# Altium schematic sheet 2024_Nov_24_Esp32.SchDoc
size A4; SheetNumber: 1; SheetTotal: 1
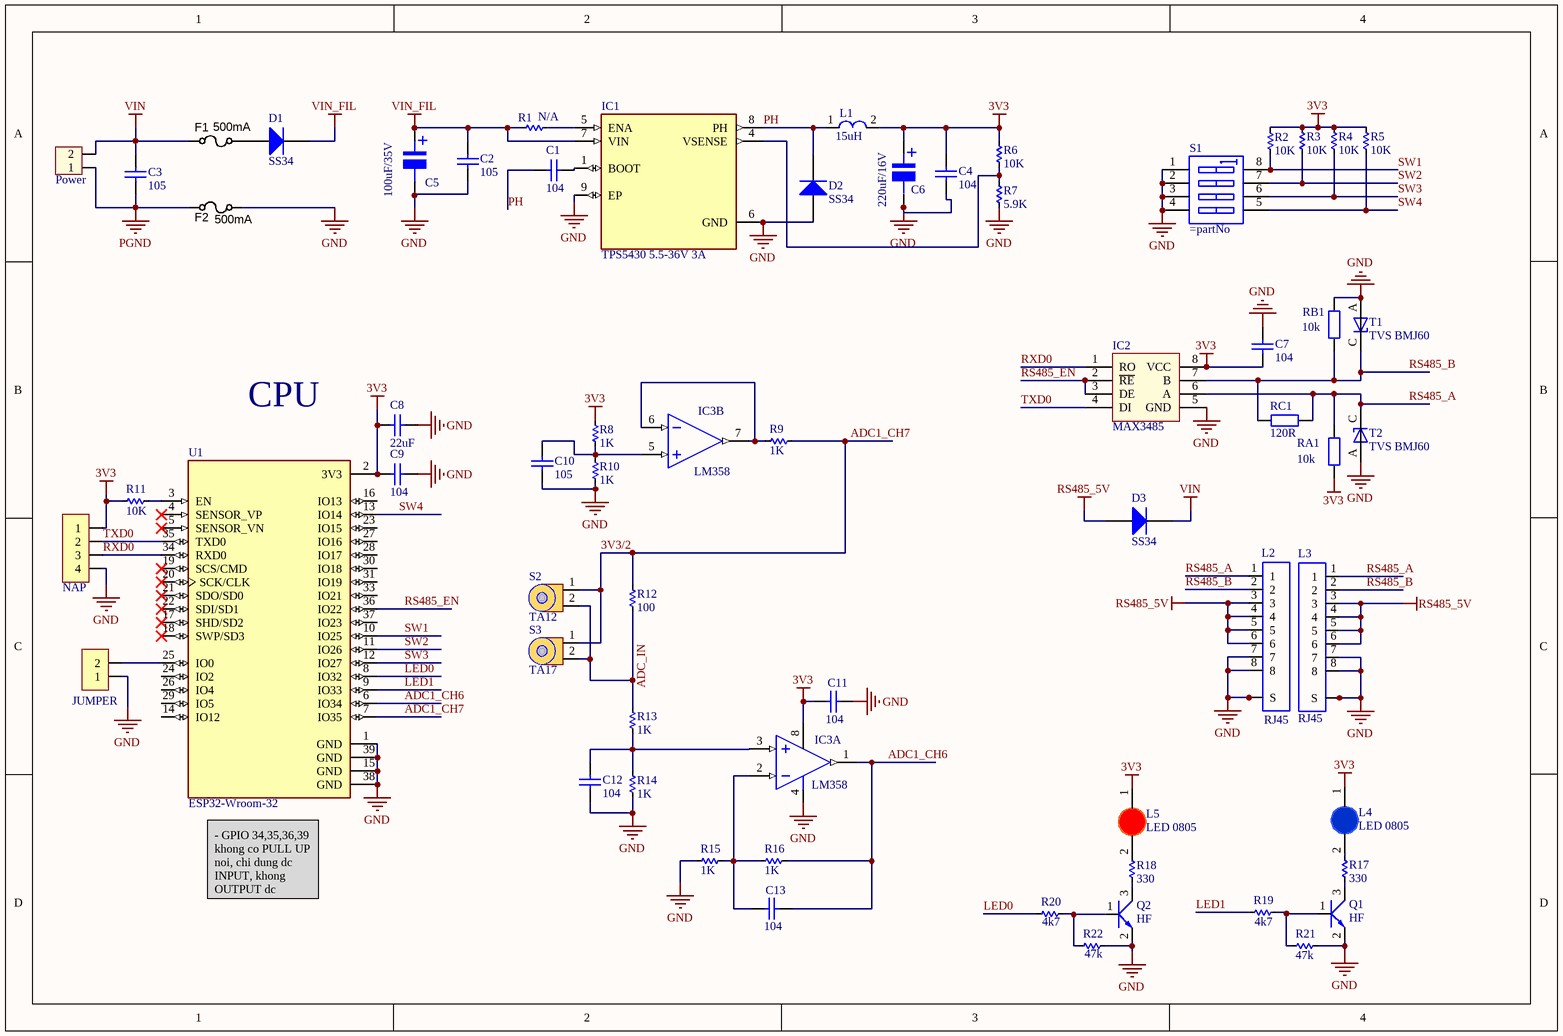
[diagram p0: 2024_Nov_24_Esp32.SchDoc]

## Parts
C1  104  [tu 0805]
C2  105  [tu 0805]
C3  105  [tu 0805]
C4  104  [tu 0805]
C5  100uF/35V  [tu nhom 8 (f)]
C6  220uF/16V  [tu nhom 6.3 (d)]
C7  104  [tu 0805]
C8  22uF  [tu 0805]
C9  104  [tu 0805]
C10  105  [tu 0805]
C11  104  [tu 0805]
C12  104  [tu 0805]
C13  104  [tu 0805]
D1  SS34  [DIODE SMA]
D2  SS34  [DIODE SMA]
D3  SS34  [DIODE SMA]
F1  value 500mA  [TU 0805]  (hidden comment: Fast Acting)
F2  value 500mA  [TU 0805]  (hidden comment: Fast Acting)
H1  Power  [XH2.54M-2]
IC1  TPS5430 5.5-36V 3A  [TPS5430]
IC2  MAX3485  [SOp 8]
IC3  LM358  [SO8]  (parts A,B of 2)
JP1  NAP  [JP 1x4 DT]
JP2  JUMPER  [JP 1x2 DT]
L1  15uH  [L-SMD-M-7.3x4.5]
L2  RJ45  [Ethernet HR911105A]
L3  RJ45  [Ethernet HR911105A]
L4  LED 0805  [LED-0805-Blue]
L5  LED 0805  [LED-0805-Red]
Q1  HF  [SOT23]
Q2  HF  [SOT23]
R1  N/A  [RES-SMD-0805]
R2  10K  [RES-SMD-0805]
R3  10K  [RES-SMD-0805]
R4  10K  [RES-SMD-0805]
R5  10K  [RES-SMD-0805]
R6  10K  [RES-SMD-0805]
R7  5.9K  [RES-SMD-0805]
R8  1K  [RES-SMD-0805]
R9  1K  [RES-SMD-0805]
R10  1K  [RES-SMD-0805]
R11  10K  [RES-SMD-0805]
R12  100  [RES-SMD-0805]
R13  1K  [RES-SMD-0805]
R14  1K  [RES-SMD-0805]
R15  1K  [RES-SMD-0805]
R16  1K  [RES-SMD-0805]
R17  330  [RES-SMD-0805]
R18  330  [RES-SMD-0805]
R19  4k7  [RES-SMD-0805]
R20  4k7  [RES-SMD-0805]
R21  47k  [RES-SMD-0805]
R22  47k  [RES-SMD-0805]
RA1  10k  [SM-RES-0805]
RB1  10k  [SM-RES-0805]
RC1  120R  [SM-RES-0805]
S1  (no value)  [SW-DIP4]
S2  TA12  [TA12]
S3  TA17  [TA12]
T1  TVS BMJ60  [TVS BMJ60]
T2  TVS BMJ60  [TVS BMJ60]
U1  ESP32-Wroom-32  [ESP32-Wroom-32]

## Nets
3V3: C4.2 C6.1 C7.1 C8.2 C9.2 C11.2 IC2.8(VCC) IC3.8(+V) JP1.1 L1.2 L4.1(A) L5.1(A) R2.2 R3.2 R4.2 R5.2 R6.1 R8.1 R11.1 RA1.1 U1.2(3V3)
GND: C2.2 C4.1 C5.2 C6.2 C7.2 C8.1 C9.1 C10.2 C11.1 C12.1 D2.1(A) F2.2 IC1.6(GND) IC1.9(EP) IC2.5(GND) IC3.4(-V) JP1.4 JP2.1 L2.7 L2.8 L2.S1(S) L2.S2(S) L3.7 L3.8 L3.S1(S) L3.S2(S) Q1.2(E) Q2.2(E) R7.2 R10.2 R14.2 R15.1 R21.1 R22.1 RB1.2 S1.1 S1.2 S1.3 S1.4 T1.A T2.A U1.1(GND) U1.15(GND) U1.38(GND) U1.39(GND)
PGND: C3.2 F2.1 H1.1
RS485_5V: D3.1(A) L2.3 L2.4 L2.5 L2.6 L3.3 L3.4 L3.5 L3.6
VIN: C3.1 D3.2(K) F1.1 H1.2
VIN_FIL: C2.1 C5.1 D1.2(K) IC1.7(VIN) R1.2
3V3/2: R9.2 R12.1 S2.1 S3.1 U1.7(IO35)  [also labelled ADC1_CH7]
ADC1_CH6: C13.1 IC3.1(OUT) R16.2 U1.6(IO34)
ADC_IN: R12.2 R13.1 S2.2 S3.2
LED0: R20.2 U1.8(IO32)
LED1: R19.2 U1.9(IO33)
PH: C1.1 D2.2(K) IC1.8(PH) L1.1
RS485_A: IC2.6(A) L2.1 L3.1 RA1.2 RC1.1 T2.C
RS485_B: IC2.7(B) L2.2 L3.2 RB1.1 RC1.2 T1.C
RS485_EN: IC2.2(~{RE}) IC2.3(DE) U1.36(IO22)
RXD0: IC2.1(RO) JP1.3 U1.34(RXD0)
SW1: R2.1 S1.8 U1.10(IO25)
SW2: R3.1 S1.7 U1.11(IO26)
SW3: R4.1 S1.6 U1.12(IO27)
SW4: R5.1 S1.5 U1.13(IO14)
TXD0: IC2.4(DI) JP1.2 U1.35(TXD0)
NetC1_2: C1.2 IC1.1(BOOT)
NetC10_1: C10.1 IC3.5(IN+) R8.2 R10.1
NetC12_2: C12.2 IC3.3(IN+) R13.2 R14.1
NetC13_2: C13.2 IC3.2(IN-) R15.2 R16.1
NetD1_1: D1.1(A) F1.2
NetIC1_4: IC1.4(VSENSE) R6.2 R7.1
NetIC1_5: IC1.5(ENA) R1.1
NetIC3_6: IC3.6(IN-) IC3.7(OUT) R9.1
NetJP2_2: JP2.2 U1.25(IO0)
NetL4_2: L4.2(K) R17.2
NetL5_2: L5.2(K) R18.2
NetQ1_1: Q1.1(B) R19.1 R21.2
NetQ1_3: Q1.3(C) R17.1
NetQ2_1: Q2.1(B) R20.1 R22.2
NetQ2_3: Q2.3(C) R18.1
NetR11_2: R11.2 U1.3(EN)

Not connected (* = marked no-connect by the designer): U1 4(SENSOR_VP)* 5(SENSOR_VN)* 14(IO12) 16(IO13) 17(SHD/SD2)* 18(SWP/SD3)* 19(SCS/CMD)* 20(SCK/CLK)* 21(SDO/SD0)* 22(SDI/SD1)* 23(IO15) 24(IO2) 26(IO4) 27(IO16) 28(IO17) 29(IO5) 30(IO18) 31(IO19) 33(IO21) 37(IO23)

## Notes on the sheet
- CPU
- (near U1) - GPIO 34,35,36,39 khong co PULL UP noi, chi dung dc INPUT, khong OUTPUT dc
  - IO2  ko noi gi moi nap dc
  - IO12 ko duoc keo tro ngoai
- (in symbol Tu Nhom 100uF 50V) +
- (in symbol Tu Nhom 220uF 16V) +

## Library data of the parts
C1-C4 C8-C13 = Tu 0805 105 50V 10%: Dán; Don_Vi: Con; So_Chan: 2; Ten_Linh_Kien: Tụ 0805 105-1uF 10% 50V; Ma_Hang: MH004552; Chung_Loai: Dán; Kieu_Chan: *
C5 = Tu Nhom 100uF 50V: Dán; Don_Vi: Con; So_Chan: 2; Ten_Linh_Kien: Tụ Nhôm 100uF 50V 8x10.2MM; Ma_Hang: MH002223; Chung_Loai: Dán; Kieu_Chan: *
C6 = Tu Nhom 220uF 16V: Dán; Don_Vi: Con; So_Chan: 2; Ten_Linh_Kien: Tụ Nhôm 220uF 16V 6.3x7.7MM; Ma_Hang: MH002227; Chung_Loai: Dán; Kieu_Chan: *
C7 = Tu 0805 104 50V 10%: Dán; Don_Vi: Con; So_Chan: 2; Ten_Linh_Kien: Tụ 0805 104-100nF 10% 50V; Ma_Hang: MH004551; Chung_Loai: Dán; Kieu_Chan: *
D1-D3 = Diode SS34 ( 1N5822 ): Dán; Don_Vi: Con; Ma_Hang: MH002104; Ten_Linh_Kien: Diode SS34 3A 40V SMA ( 1N5822 SS34A); Kieu_Chan: *; Chung_Loai: Dán
F1 F2 = FUSE_FAST_500mA_0603: Fuse 500mA 32VDC 0603 SMD; Manufacturer 1: AVX Corporation; Manufacturer Part Number 1: F0603E0R50FSTR; Ratings: 500mA; 32VDC; fast acting; DC Cold Resistance: 0.25 Ohm; SCDType: source; Package / Case: 0603 (1608 metric); Fuse Type: Fast Acting; ComponentLink1URL: http://www.avx.com/docs/Catalogs/accug2.pdf; ComponentLink1Description: http://www.avx.com/docs/Catalogs/accug2.pdf; Supplier 1: Digi-Key; Supplier Part Number 1: 478-2860-1-ND; Operating Temperature: -55°C ~ 125°C
H1 = Header 2P 2.54 Duc Thang: Cắm; Ten_Linh_Kien: Header 2P XH2.54-2P Đực Thẳng; Don_Vi: Con; Ma_Hang: MH001283; Chung_Loai: Cắm
IC1 = TPS5430: BUY: https://www.mouser.vn/ProductDetail/Texas-Instruments/TPS5430DDAR?qs=zwk82MlA57ZJdOTovH1aYA%3D%3D       DATASHEET: https://pdf1.alldatasheet.com/datasheet-pdf/view/132224/TI/TPS5430.html
IC2 = MAX485: RS232 - RS485 (Same sn75176)
IC3 = LM358: Low-Power Dual Operational Amplifier; Value: LM358
JP1 = JP 1x4 2.54 Duc Thang: Cắm; Ten_Linh_Kien: Jump Đơn Đực 2.54MM 1x40P Thẳng 11MM; Don_Vi: Con; Ma_Hang: MH000903; Ghi_Chu: *; Kieu_Chan: *; Chung_Loai: Cắm
JP2 = JP 1x2 2.54 Duc Thang: Cắm; Ten_Linh_Kien: Jump Đơn Đực 2.54MM 1x40P Thẳng 11MM; Don_Vi: Con; Ma_Hang: MH000903; Ghi_Chu: *; Kieu_Chan: *; Chung_Loai: Cắm
L1 = L-SMD-1: partNo: 78477010; Manufacturer: Wurth Elektronik; Inductance: 1.0 μH; ComponentLink1Description: Manufacturer; ComponentLink1URL: http://www.we-online.de; Created by: Baojun Chen; Created Date: Nov.2015; ComponentLink2Description: Datasheet; ComponentLink2URL: http://katalog.we-online.de/pbs/datasheet/78477010.pdf
L2 L3 = Ethernet-LAN
L4 = LED 0805 Xanh Duong: Dán; Don_Vi: Con; Ma_Hang: MH002327; Ten_Linh_Kien: LED 0805 Màu Xanh Dương (Blue); Ghi_Chu: *; Kieu_Chan: *; Chung_Loai: Dán
L5 = LED 0805 Do: Dán; Don_Vi: Con; Ma_Hang: MH000897; Ten_Linh_Kien: LED 0805 Màu Đỏ (Red); Ghi_Chu: *; Kieu_Chan: *; Chung_Loai: Dán
Q1 Q2 = C1815 HF SMD: NPN transistor; Value: C9014
R1-R22 = Res-SMD: Resistor; Manufacturer: Generic Components; Class: Passive; Published: 08/06/2000; Publisher: Altium Hobart Technology Centre
RA1 RB1 RC1 = R1/4W: Resistor 1/4W; Value: R1/4W - 1K
S1 = SWDIP4: WS-DITV 2.54 mm small compact THT flat actuator with top tape; Manufacturer: Wurth Elektronik; Part No.: 418127160904; ComponentLink1 Description: Manufacturer; ComponentLink2 Description: Datasheet; Pole: 04; Created Date: Dec.2015; ComponentLink1URL: http://www.we-online.com; ComponentLink2URL: http://katalog.we-online.de/em/datasheet/4181271609xx.pdf; Created by: Baojun Chen
S3 = TA12